# Altium schematic sheet FEM.SchDoc
size A4
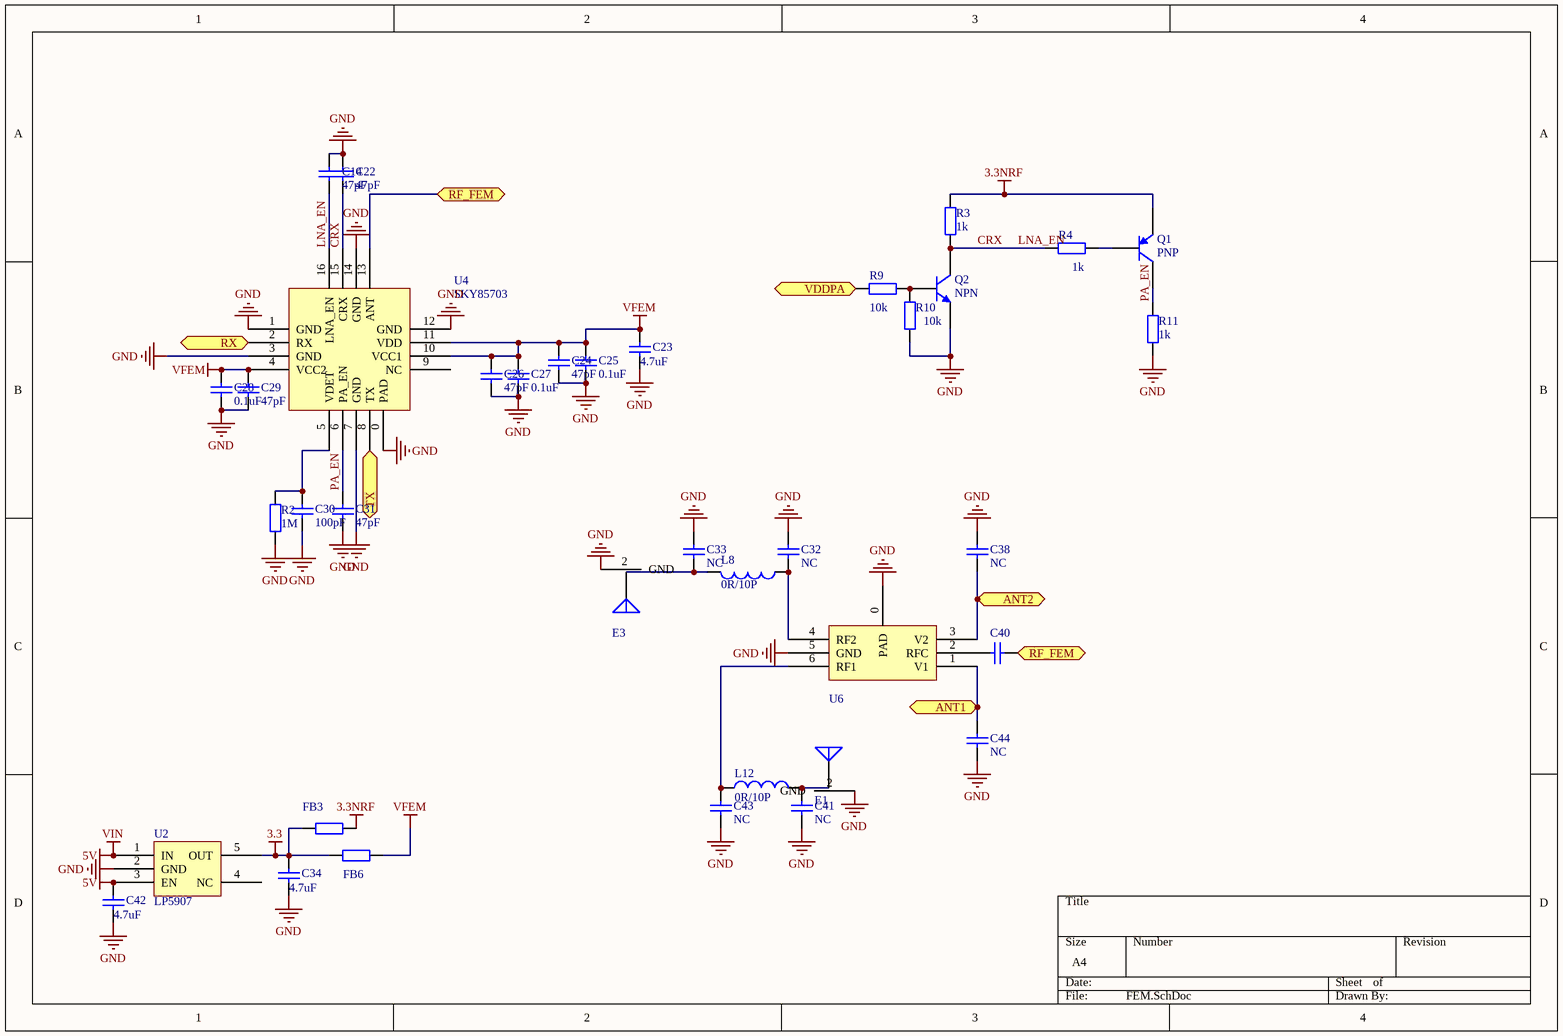
[diagram p0: FEM.SchDoc]

## Parts
C14  47pF  [0402]
C22  47pF  [0402]
C23  4.7uF  [0805]
C24  47pF  [0402]
C25  0.1uF  [0402]
C26  47pF  [0402]
C27  0.1uF  [0402]
C28  0.1uF  [0402]
C29  47pF  [0402]
C30  100pF  [0402]
C31  47pF  [0402]
C32  NC  [0402]
C33  NC  [0402]
C34  4.7uF  [0603]
C38  value NC  [0402]  (hidden comment: Cap)
C40  10p  [0402]  (value not drawn)
C41  value NC  [0402]  (hidden comment: Cap)
C42  4.7uF  [0603]
C43  value NC  [0402]  (hidden comment: Cap)
C44  value NC  [0402]  (hidden comment: Cap)
E1  Antenna  [IPEX]  (value not drawn)
E3  Antenna  [IPEX]  (value not drawn)
FB3  Res2  [0402]  (value not drawn)
FB6  Res2  [0402]  (value not drawn)
L8  0R/10P  [0402]
L12  value 0R/10P  [0402]  (hidden comment: Inductor)
Q1  PNP  [LC-SOT-323(SC-70)]
Q2  NPN  [LC-SOT-323(SC-70)]
R2  value 1M  [0402]  (hidden comment: Res2)
R3  value 1k  [0402]  (hidden comment: Res2)
R4  value 1k  [0402]  (hidden comment: Res2)
R9  10k  [0402]
R10  10k  [0402]
R11  value 1k  [0402]  (hidden comment: Res2)
U2  LP5907  [SOT23-5]
U4  SKY85703  [QFN16-3x3]
U6  SKY13370-374LF  [SKY65404-31]  (value not drawn)

## Ports
ANT1, ANT2, RF_FEM, RX, TX, VDDPA

## Nets
3.3: C34.2 FB3.1 FB6.1 U2.5(OUT)
3.3NRF: FB3.2 Q1.2(E) R3.1
5V: C42.2 U2.1(IN) U2.3(EN)  [also labelled VIN]
GND: C14.2 C22.1 C23.1 C24.1 C25.1 C26.1 C27.1 C28.1 C29.1 C30.1 C31.1 C32.1 C33.1 C34.1 C38.1 C41.2 C42.1 C43.2 C44.1 E1.2(GND) E3.2(GND) Q2.2(E) R2.2 R10.1 R11.1 U2.2(GND) U4.0(PAD) U4.1(GND) U4.3(GND) U4.7(GND) U4.12(GND) U4.14(GND) U6.0(PAD) U6.5(GND)
VFEM: C23.2 C24.2 C25.2 C26.2 C27.2 C28.2 C29.2 FB6.2 U4.4(VCC2) U4.10(VCC1) U4.11(VDD)
ANT1: C44.2 U6.1(V1) ; port ANT1
ANT2: C38.2 U6.3(V2) ; port ANT2
CRX: C14.1 C22.2 Q2.3(C) R3.2 R4.1 U4.15(CRX) U4.16(LNA_EN)  [also labelled LNA_EN]
PA_EN: C31.2 Q1.3(C) R11.2 U4.6(PA_EN)
RF_FEM: C40.2 U4.13(ANT) ; port RF_FEM
RX: U4.2(RX) ; port RX
TX: U4.8(TX) ; port TX
VDDPA: R9.1 ; port VDDPA
NetC30_2: C30.2 R2.1 U4.5(VDET)
NetC32_2: C32.2 L8.1 U6.4(RF2)
NetC33_2: C33.2 E3.1(ANT) L8.2
NetC40_1: C40.1 U6.2(RFC)
NetC41_1: C41.1 E1.1(ANT) L12.2
NetC43_1: C43.1 L12.1 U6.6(RF1)
NetQ1_1: Q1.1(B) R4.2
NetQ2_1: Q2.1(B) R9.2 R10.2

Not connected (* = marked no-connect by the designer): U2 4(NC); U4 9(NC)

## Library data of the parts
C14 C22-C34 C38 C41-C44 = Cap: Capacitor; Published: 8-Jun-2000; LatestRevisionDate: 17-Jul-2002; LatestRevisionNote: Re-released for DXP Platform.; PackageReference: RAD-0.3; Publisher: Altium Limited; PackageDescription: Radial Cap, Thru-Hole; 2 Leads; 0.3 in Pin Spacing
C40 = Cap: Capacitor; Value: NC; Published: 8-Jun-2000; LatestRevisionDate: 17-Jul-2002; LatestRevisionNote: Re-released for DXP Platform.; PackageReference: RAD-0.3; Publisher: Altium Limited; PackageDescription: Radial Cap, Thru-Hole; 2 Leads; 0.3 in Pin Spacing
E1 E3 = Antenna: Generic Antenna; Published: 24-Mar-1999; LatestRevisionDate: 17-Jul-2002; LatestRevisionNote: Re-released for DXP Platform.; PackageReference: PIN1; Publisher: Altium Limited
FB3 FB6 = Res2: Resistor; Value: FB; Published: 8-Jun-2000; LatestRevisionDate: 17-Jul-2002; LatestRevisionNote: Re-released for DXP Platform.; PackageReference: AXIAL-0.4; Publisher: Altium Limited; PackageDescription: Axial Device, Thru-Hole; 2 Leads; 0.4 in Pin Spacing
L8 L12 = Inductor: Code_IEC: 1005; Published: 8-Jun-2000; LatestRevisionDate: 29-May-2009; LatestRevisionNote: IPC-7351 Footprint Added.; PackageReference: 0402-A; Publisher: Altium Limited; PackageDescription: Chip Inductor; Code_JEITA: 0402
Q1 = PNP: PNP Bipolar Transistor; Published: 8-Jun-2000; LatestRevisionDate: 29-May-2009; LatestRevisionNote: IPC-7351 Footprint Added.; PackageVersion: Aug-1999; PackageReference: SOT-23B; Publisher: Altium Limited; PackageDescription: 3-Pin SOT-23 Package 0.95 mm Pitch, 2.4 mm Lead Span
Q2 = NPN: NPN Bipolar Transistor; Published: 8-Jun-2000; LatestRevisionDate: 17-Jul-2002; LatestRevisionNote: Re-released for DXP Platform.; PackageReference: TO-226-AA; Publisher: Altium Limited; PackageDescription: TO, Flat Index; 3 In-Line, Axial Leads; Body Dia. 4.8mm; Leads 0.55 x 0.51 mm (max); Code_JEDEC: TO-226-AA
R2-R4 R9-R11 = Res2: Resistor; Published: 8-Jun-2000; LatestRevisionDate: 17-Jul-2002; LatestRevisionNote: Re-released for DXP Platform.; PackageReference: AXIAL-0.4; Publisher: Altium Limited; PackageDescription: Axial Device, Thru-Hole; 2 Leads; 0.4 in Pin Spacing